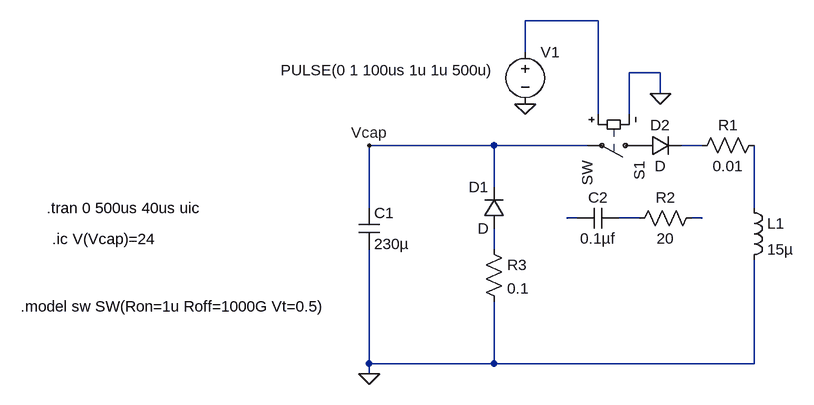
[diagram p0: schematic discharge.asc]
discharge.asc, the LTspice schematic file:
Version 4
SHEET 1 1380 680
WIRE 336 -208 224 -208
WIRE 224 -160 224 -208
WIRE 432 -128 384 -128
WIRE 432 -96 432 -128
WIRE 336 -64 336 -208
WIRE 384 -64 384 -128
WIRE 176 -16 -16 -16
WIRE 320 -16 176 -16
WIRE 496 -16 464 -16
WIRE 176 48 176 -16
WIRE -16 80 -16 -16
WIRE 576 80 576 -16
WIRE 304 96 288 96
WIRE 400 96 368 96
WIRE 496 96 480 96
WIRE 176 144 176 112
WIRE -16 320 -16 144
WIRE 176 320 176 224
WIRE 176 320 -16 320
WIRE 576 320 576 160
WIRE 576 320 176 320
WIRE -16 336 -16 320
FLAG -16 -16 Vcap
FLAG -16 336 0
FLAG 224 -80 0
FLAG 432 -96 0
SYMBOL res 592 -32 R90
WINDOW 0 0 56 VBottom 2
WINDOW 3 32 56 VTop 2
SYMATTR InstName R1
SYMATTR Value 0.01
SYMBOL ind 560 64 R0
SYMATTR InstName L1
SYMATTR Value 15µ
SYMATTR SpiceLine Rser=0
SYMBOL diode 400 0 R270
WINDOW 0 32 32 VTop 2
WINDOW 3 0 32 VBottom 2
SYMATTR InstName D2
SYMBOL voltage 224 -176 R0
WINDOW 3 -376 44 Left 2
WINDOW 123 0 0 Left 0
WINDOW 39 0 0 Left 0
SYMATTR Value PULSE(0 1 100us 1u 1u 500u)
SYMATTR InstName V1
SYMBOL cap -32 80 R0
SYMATTR InstName C1
SYMATTR Value 230µ
SYMBOL sw 416 -16 R90
SYMATTR InstName S1
SYMBOL cap 368 80 R90
WINDOW 0 0 32 VBottom 2
WINDOW 3 32 32 VTop 2
SYMATTR InstName C2
SYMATTR Value 0.1µf
SYMBOL res 496 80 R90
WINDOW 0 0 56 VBottom 2
WINDOW 3 32 56 VTop 2
SYMATTR InstName R2
SYMATTR Value 20
SYMBOL diode 192 112 R180
WINDOW 0 24 64 Left 2
WINDOW 3 24 0 Left 2
SYMATTR InstName D1
SYMBOL res 160 128 R0
SYMATTR InstName R3
SYMATTR Value 0.1
TEXT -512 80 Left 2 !.tran 0 500us 40us uic
TEXT -504 128 Left 2 !.ic V(Vcap)=24
TEXT -552 232 Left 2 !.model sw SW(Ron=1u Roff=1000G Vt=0.5)

The netlist it stands for:
* discharge.asc
R1 N003 N002 0.01
L1 N003 0 15µ Rser=0
D2 P001 N002 D
V1 N001 0 PULSE(0 1 100us 1u 1u 500u)
C1 Vcap 0 230µ
S1 P001 Vcap N001 0 SW
C2 N005 N004 0.1µf
R2 N006 N005 20
D1 N007 Vcap D
R3 N007 0 0.1
.model D D
.lib standard.dio
.tran 0 500us 40us uic
.ic V(Vcap)=24
.model sw SW(Ron=1u Roff=1000G Vt=0.5)
.backanno
.end